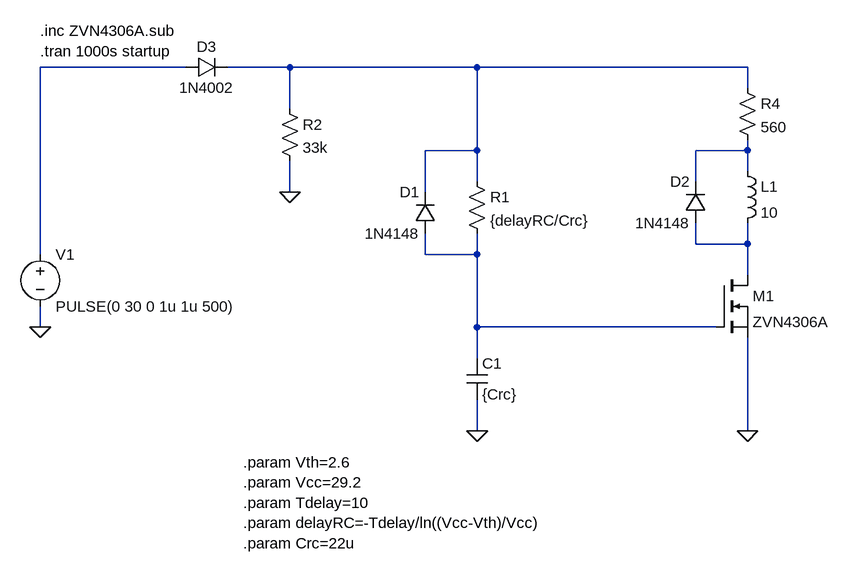
[diagram p0: schematic Protection relay.asc]
Protection relay.asc, the LTspice schematic file:
Version 4
SHEET 1 1092 680
WIRE 96 -32 -128 -32
WIRE 256 -32 160 -32
WIRE 544 -32 256 -32
WIRE 960 -32 544 -32
WIRE 960 0 960 -32
WIRE 256 32 256 -32
WIRE 544 96 544 -32
WIRE 544 96 464 96
WIRE 960 96 960 80
WIRE 960 96 880 96
WIRE 960 128 960 96
WIRE 544 144 544 96
WIRE 880 144 880 96
WIRE 256 160 256 112
WIRE 464 160 464 96
WIRE 880 240 880 208
WIRE 960 240 960 208
WIRE 960 240 880 240
WIRE -128 256 -128 -32
WIRE 464 256 464 224
WIRE 544 256 544 224
WIRE 544 256 464 256
WIRE 960 288 960 240
WIRE -128 368 -128 336
WIRE 544 368 544 256
WIRE 912 368 544 368
WIRE 544 416 544 368
WIRE 544 528 544 480
WIRE 960 528 960 384
FLAG -128 368 0
FLAG 544 528 0
FLAG 960 528 0
FLAG 256 160 0
SYMBOL voltage -128 240 R0
SYMATTR InstName V1
SYMATTR Value PULSE(0 30 0 1u 1u 500)
SYMBOL res 528 128 R0
SYMATTR InstName R1
SYMATTR Value {delayRC/Crc}
SYMBOL cap 528 416 R0
SYMATTR InstName C1
SYMATTR Value {Crc}
SYMBOL nmos 912 288 R0
SYMATTR InstName M1
SYMATTR Value ZVN4306A
SYMATTR Prefix X
SYMBOL res 944 -16 R0
SYMATTR InstName R4
SYMATTR Value 560
SYMBOL ind 944 112 R0
SYMATTR InstName L1
SYMATTR Value 10
SYMATTR SpiceLine Rser=2.15k
SYMBOL diode 896 208 R180
WINDOW 0 24 64 Left 2
WINDOW 3 24 0 Left 2
SYMATTR InstName D2
SYMATTR Value 1N4148
SYMBOL diode 480 224 R180
WINDOW 0 24 64 Left 2
WINDOW 3 24 0 Left 2
SYMATTR InstName D1
SYMATTR Value 1N4148
SYMBOL diode 96 -16 R270
WINDOW 0 32 32 VTop 2
WINDOW 3 0 32 VBottom 2
SYMATTR InstName D3
SYMATTR Value 1N4002
SYMBOL res 240 16 R0
SYMATTR InstName R2
SYMATTR Value 33k
TEXT -128 -88 Left 2 !.inc ZVN4306A.sub\n.tran 1000s startup
TEXT 184 576 Left 2 !.param Vth=2.6\n.param Vcc=29.2\n.param Tdelay=10\n.param delayRC=-Tdelay/ln((Vcc-Vth)/Vcc)\n.param Crc=22u

The netlist it stands for:
* Protection relay.asc
V1 N001 0 PULSE(0 30 0 1u 1u 500)
R1 N002 N005 {delayRC/Crc}
C1 N005 0 {Crc}
XM1 N004 N005 0 ZVN4306A  ; pins D G S
R4 N002 N003 560
L1 N003 N004 10 Rser=2.15k
D2 N004 N003 1N4148
D1 N005 N002 1N4148
D3 N001 N002 1N4002
R2 N002 0 33k
.model D D
.lib standard.dio
.inc ZVN4306A.sub
.tran 1000s startup
.param Vth=2.6
.param Vcc=29.2
.param Tdelay=10
.param delayRC=-Tdelay/ln((Vcc-Vth)/Vcc)
.param Crc=22u
.backanno
.end